# Altium schematic sheet Charger Interface - J1772 Interface.SchDoc: Charger Interface - J1772 Interface
size B; Organization: Midnight Sun Solar Rayce Car Team; Address1: University of Waterloo; Address2: 200 University Ave W; Address3: Waterloo, ON, Canada; Address4: N2L 3E9; DocumentNumber: 3; SheetNumber: 3; SheetTotal: 3; Website: www.uwmidsun.com; ProjectName: ProjectName
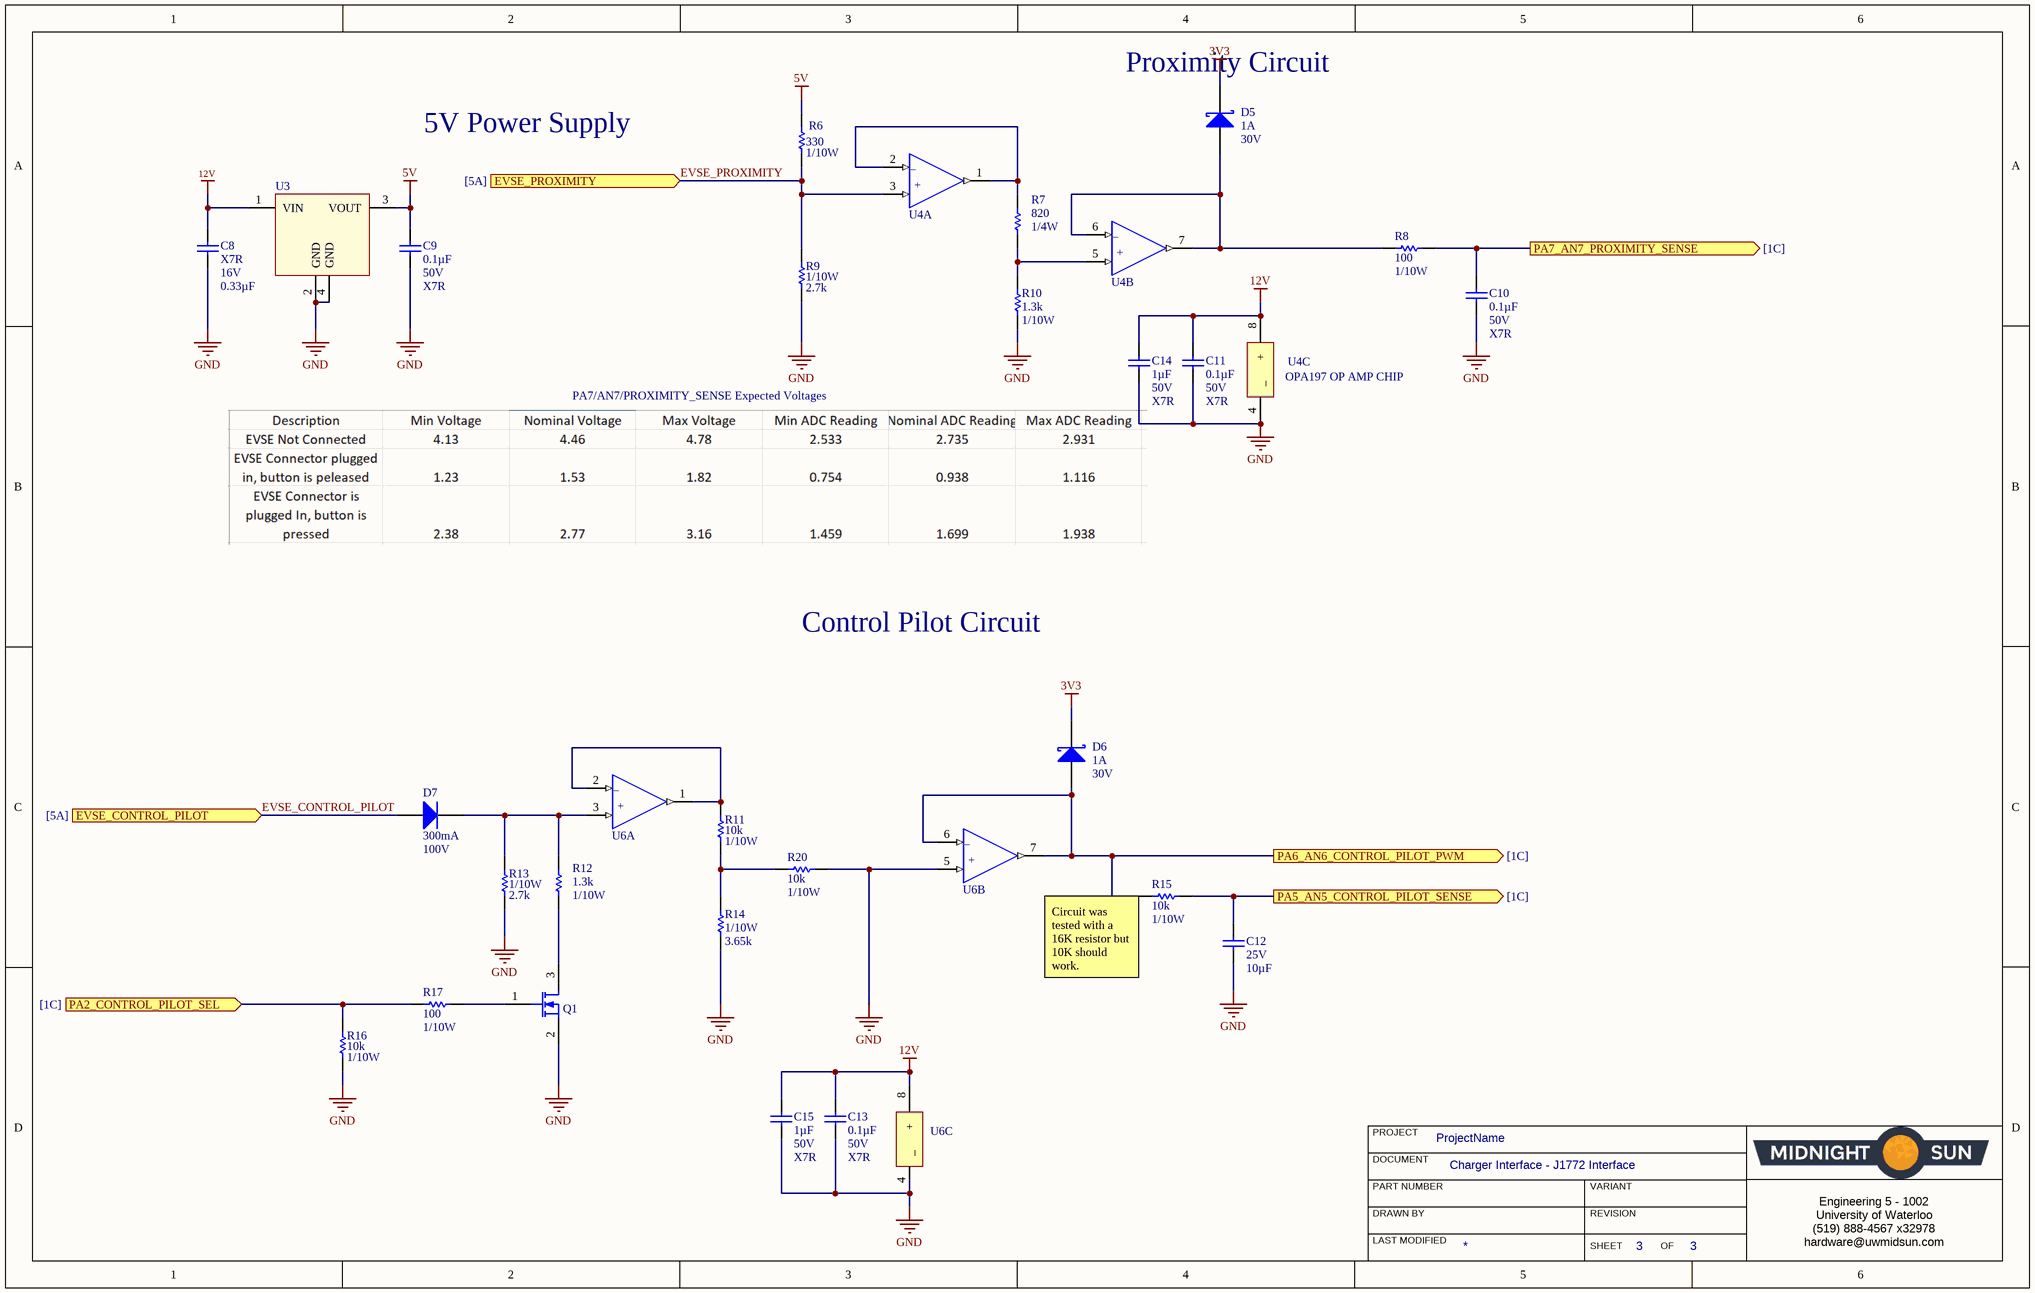
[diagram p0: Charger Interface - J1772 Interface.SchDoc]

## Parts
C8  Dielectric: X7R  Voltage: 16V  Capacitance: 0.33µF  [CAP, 0603]  (hidden comment: CAP CER 0.33UF 16V 10% X7R 0603)
C9  Capacitance: 0.1µF  Voltage: 50V  Temperature Coefficient: X7R  [CAP, 0603]  (hidden comment: CAP CER 0.1UF 50V 10% X7R 0603)
C10  Capacitance: 0.1µF  Voltage: 50V  Temperature Coefficient: X7R  [CAP, 0603]  (hidden comment: CAP CER 0.1UF 50V 10% X7R 0603)
C11  Capacitance: 0.1µF  Voltage: 50V  Temperature Coefficient: X7R  [CAP, 0603]  (hidden comment: CAP CER 0.1UF 50V 10% X7R 0603)
C12  Voltage - Rated: 25V  Capacitance: 10µF  [CAP, 0805]  (hidden comment: CAP CER 10uF 25V 10% X5R 0805)
C13  Capacitance: 0.1µF  Voltage: 50V  Temperature Coefficient: X7R  [CAP, 0603]  (hidden comment: CAP CER 0.1UF 50V 10% X7R 0603)
C14  Capacitance: 1µF  Voltage: 50V  Temperature Coefficient: X7R  [CAP, 0603]  (hidden comment: CAP CER 1UF 50V 10% X7R 0603)
C15  Capacitance: 1µF  Voltage: 50V  Temperature Coefficient: X7R  [CAP, 0603]  (hidden comment: CAP CER 1UF 50V 10% X7R 0603)
D5  Current - Average Rectified (Io): 1A  Voltage - DC Reverse (Vr) (Max): 30V  [DIODE SCHOTTKY 30V 1A POWERDI123]  (hidden comment: DIODE SCHOTTKY 30V 1A POWERDI123)
D6  Current - Average Rectified (Io): 1A  Voltage - DC Reverse (Vr) (Max): 30V  [DIODE SCHOTTKY 30V 1A POWERDI123]  (hidden comment: DIODE SCHOTTKY 30V 1A POWERDI123)
D7  Forward Current: 300mA  Max Repetitive Reverse Voltage (Vrrm): 100V  [DIODE GEN PURP 100V 300MA SOD123]  (hidden comment: DIODE GEN PURP 100V 300MA SOD123)
Q1  MOSFET N-CH 30V 6.2A 0.9W SOT-23  [MOSFET N-CH 30V 6.2A 0.9W SOT-23]  (value not drawn)
R6  Resistance: 330  Power: 1/10W  [RES, 0603]  (hidden comment: RES 330 OHM 1% 1/10W 0603)
R7  Resistance: 820  Power: 1/4W  [RES, 0603]  (hidden comment: RES 820 OHM 5% 1/4W 0603)
R8  Resistance: 100  Power: 1/10W  [RES, 0603]  (hidden comment: RES 100 OHM 1% 1/10W 0603)
R9  Power: 1/10W  Resistance: 2.7k  [RES, 0603]  (hidden comment: RES 2.7K OHM 1% 1/10W 0603)
R10  Resistance: 1.3k  Power Rating: 1/10W  [RES, 0603]  (hidden comment: RES 1.3K OHM 1% 1/10W 0603)
R11  Resistance: 10k  Power: 1/10W  [RES, 0603]  (hidden comment: RES 10K OHM 1% 1/10W 0603)
R12  Resistance: 1.3k  Power Rating: 1/10W  [RES, 0603]  (hidden comment: RES 1.3K OHM 1% 1/10W 0603)
R13  Power: 1/10W  Resistance: 2.7k  [RES, 0603]  (hidden comment: RES 2.7K OHM 1% 1/10W 0603)
R14  Power Rating: 1/10W  Resistance: 3.65k  [RES, 0603]  (hidden comment: RES 3.65K OHM 0.1% 1/10W 0603)
R15  Resistance: 10k  Power: 1/10W  [RES, 0603]  (hidden comment: RES 10K OHM 1% 1/10W 0603)
R16  Resistance: 10k  Power: 1/10W  [RES, 0603]  (hidden comment: RES 10K OHM 1% 1/10W 0603)
R17  Resistance: 100  Power: 1/10W  [RES, 0603]  (hidden comment: RES 100 OHM 1% 1/10W 0603)
R20  Resistance: 10k  Power: 1/10W  [RES, 0603]  (hidden comment: RES 10K OHM 1% 1/10W 0603)
U3  IC REG LDO 5V 0.5A SOT223  [SOT223_N]  (value not drawn)
U4  IC OP AMP DUAL GP RR 10MHZ 8-VSSOP  [IC DUAL OPAMP OPA2197 8-VSSOP]  (value not drawn)  (parts A,B,C of 3)
U6  IC OP AMP DUAL GP RR 10MHZ 8-VSSOP  [IC DUAL OPAMP OPA2197 8-VSSOP]  (value not drawn)  (parts A,B,C of 3)

## Ports
EVSE_CONTROL_PILOT (in, see [5A]), EVSE_PROXIMITY (in, see [5A]), PA2_CONTROL_PILOT_SEL (in, see [1C]), PA5_AN5_CONTROL_PILOT_SENSE (out, see [1C]), PA6_AN6_CONTROL_PILOT_PWM (out, see [1C]), PA7_AN7_PROXIMITY_SENSE (out, see [1C])

## Nets
3V3: D5.2(K) D6.2(K)
5V: C9.1 R6.1 U3.3(VOUT)
12V: C8.1 C11.1 C13.1 C14.1 C15.1 U3.1(VIN) U4.8(+) U6.8(+)
GND: C8.2 C9.2 C10.2 C11.2 C12.2 C13.2 C14.2 C15.2 Q1.2(S) R9.2 R10.2 R13.2 R14.2 R16.2 R20.2 U3.2(GND) U3.4(GND) U4.4(_) U6.4(_) U6.5(+IN_B)
EVSE_CONTROL_PILOT: D7.1(A) ; port EVSE_CONTROL_PILOT
EVSE_PROXIMITY: R6.2 R9.1 U4.3(+IN_A) ; port EVSE_PROXIMITY
PA2_CONTROL_PILOT_SEL: R16.1 R17.1 ; port PA2_CONTROL_PILOT_SEL
PA5_AN5_CONTROL_PILOT_SENSE: C12.1 R15.2 ; port PA5_AN5_CONTROL_PILOT_SENSE
PA6_AN6_CONTROL_PILOT_PWM: D6.1(A) R15.1 U6.6(-IN_B) U6.7(OUT_B) ; port PA6_AN6_CONTROL_PILOT_PWM
PA7_AN7_PROXIMITY_SENSE: C10.1 R8.2 ; port PA7_AN7_PROXIMITY_SENSE
NetD5_1: D5.1(A) R8.1 U4.6(-IN_B) U4.7(OUT_B)
NetD7_2: D7.2(K) R12.1 R13.1 U6.3(+IN_A)
NetQ1_1: Q1.1(G) R17.2
NetQ1_3: Q1.3(D) R12.2
NetR7_1: R7.1 U4.1(OUT_A) U4.2(-IN_A)
NetR7_2: R7.2 R10.1 U4.5(+IN_B)
NetR11_1: R11.1 U6.1(OUT_A) U6.2(-IN_A)
NetR11_2: R11.2 R14.1 R20.1

## Notes on the sheet
- Proximity Circuit
- 5V Power Supply
- PA7/AN7/PROXIMITY_SENSE Expected Voltages
- (near U4) OPA197 OP AMP CHIP
- Control Pilot Circuit
- (near R15) Circuit was tested with a 16K resistor but 10K should work.
- PROJECT
- DOCUMENT
- DRAWN BY
- LAST MODIFIED
- PART NUMBER
- REVISION
- SHEET
- VARIANT
- OF
- Engineering 5 - 1002
  University of Waterloo
  (519) 888-4567 x32978
  hardware@uwmidsun.com

## Library data of the parts
C8 = CAP CER 0.33UF 16V 10% X7R 0603: 0.33µF ±10% 16V Ceramic Capacitor X7R 0603 (1608 Metric); Manufacturer: KEMET; Manufacturer Part Number: C0603C334K4RACTU; Dissipation Factor: 3.5%; Supplier 1: Digi-Key; Stock 1: 94306; Pricing 1: 1=0.3, 10=0.207, 100=0.1173, 500=0.0828, 1000=0.0725 (USD); Mount: Surface Mount,PCB; Case/Package: 0603; Number of Pins: 2; Case Code (Metric): 1608; Case Code (Imperial): 0603; Dielectric Material: Ceramic; Min Operating Temperature: -55°C; Max Operating Temperature: 125°C; Tolerance: 10%; Packaging: Tape and Reel; Voltage Rating: 16V; Voltage Rating (DC): 16V; Package Quantity: 1; Termination: SMD/SMT; Length: 1.6mm; Height: 0.8mm; Width: 0.8mm; Thickness: 0.034inch; Lead Pitch: 0.7mm; Depth: 0.8mm; Radiation Hardening: No; REACH SVHC: No SVHC; ComponentLink1URL: https://datasheet.ciiva.com/5417/kem-c1002-x7r-smd-5417833.pdf; ComponentLink1Description: https://datasheet.ciiva.com/5417/kem-c1002-x7r-smd-5417833.pdf; ComponentLink2URL: https://datasheet.ciiva.com/14594/70095383-14594697.pdf; ComponentLink2Description: https://datasheet.ciiva.com/14594/70095383-14594697.pdf; ComponentLink3URL: https://datasheet.ciiva.com/6136/1776092-6136493.pdf; ComponentLink3Description: https://datasheet.ciiva.com/6136/1776092-6136493.pdf; ComponentLink4URL: https://datasheet.ciiva.com/7823/1776092-7823757.pdf; ComponentLink4Description: https://datasheet.ciiva.com/7823/1776092-7823757.pdf; ComponentLink5URL: https://datasheet.ciiva.com/7823/1776092-7823758.pdf; ComponentLink5Description: https://datasheet.ciiva.com/7823/1776092-7823758.pdf; ComponentLink6URL: https://datasheet.ciiva.com/14596/70095383-14596430.pdf; ComponentLink6Description: https://datasheet.ciiva.com/14596/70095383-14596430.pdf; Supplier Part Number 1: 399-4916-1-ND
C9-C11 C13 = CAP CER 0.1UF 50V 10% X7R 0603: 0.10µF ±10% 50V Ceramic Capacitor X7R 0603 (1608 Metric); Manufacturer 1: AVX Corporation; Manufacturer Part Number 1: 06035C104KAT2A; Supplier 1: Digi-Key; Supplier Part Number 1: 478-5052-1-ND; Packaging: Cut Tape (CT); Part Status: Active; Operating Temperature: -55°C ~ 125°C; Ratings: -; Mounting Type: Surface Mount, MLCC; Package / Case: 0603 (1608 Metric); Size / Dimension: 0.063" L x 0.032" W (1.60mm x 0.81mm); Height - Seated (Max): -; Thickness (Max): 0.035" (0.90mm); Lead Spacing: -; Lead Style: -; ComponentLink1URL: http://datasheets.avx.com/X7RDielectric.pdf; ComponentLink1Description: http://datasheets.avx.com/X7RDielectric.pdf; Tolerance: ±10%
C12 = CAP CER 10uF 25V 10% X5R 0805: 10µF ±10% 25V Ceramic Capacitor X5R 0805 (2012 Metric); Manufacturer: Murata Electronics North America; Manufacturer Part Number: GRM21BR61E106KA73L; Supplier 1: Digi-Key; RoHS: RoHS Compliant; Category: Capacitors; Stock 1: 1695157; Packaging: Cut Tape (CT); Part Status: Active; Tolerance: ±10%; Temperature Coefficient: X5R; Operating Temperature: -55°C ~ 85°C; Features: -; Ratings: -; Applications: General Purpose; Mounting Type: Surface Mount, MLCC; Package / Case: 0805 (2012 Metric); Size / Dimension: 0.079" L x 0.049" W (2.00mm x 1.25mm); Height - Seated (Max): -; Thickness (Max): 0.053" (1.35mm); Lead Spacing: -; Lead Style: -; ComponentLink1URL: http://search.murata.co.jp/Ceramy/image/img/A01X/G101/ENG/GRM21BR61E106KA73-01.pdf; ComponentLink1Description: http://search.murata.co.jp/Ceramy/image/img/A01X/G101/ENG/GRM21BR61E106KA73-01.pdf; Supplier Part Number 1: 490-5523-1-ND; Pricing 1: 1=0.3, 10=0.214, 100=0.1008, 500=0.07068, 1000=0.05851 (CAD)
C14 C15 = CAP CER 1UF 50V 10% X7R 0603: 1µF ±10% 50V Ceramic Capacitor X7R 0603 (1608 Metric); Manufacturer 1: Taiyo Yuden; Manufacturer Part Number 1: UMK107AB7105KA-T; Supplier 1: Digi-Key; Supplier Part Number 1: 587-3247-1-ND; Packaging: Cut Tape (CT); Part Status: Active; Operating Temperature: -55°C ~ 125°C; Ratings: -; Mounting Type: Surface Mount, MLCC; Package / Case: 0603 (1608 Metric); Size / Dimension: 0.063" L x 0.031" W (1.60mm x 0.80mm); Height - Seated (Max): -; Thickness (Max): 0.037" (0.95mm); Lead Spacing: -; Lead Style: -; ComponentLink1URL: http://www.yuden.co.jp/productdata/catalog/en/mlcc_all_e.pdf; ComponentLink1Description: http://www.yuden.co.jp/productdata/catalog/en/mlcc_all_e.pdf; Tolerance: ±10%
D5 D6 = DIODE SCHOTTKY 30V 1A POWERDI123: Diode Schottky 30V 1A Surface Mount PowerDI™ 123; Manufacturer: Diodes Incorporated; Manufacturer Part Number: DFLS130L-7; Speed: Fast Recovery =< 500ns, > 200mA (Io); Current - Reverse Leakage @ Vr: 1mA @ 30V; Capacitance @ Vr, F: 76pF @ 10V, 1MHz; Voltage - Forward (Vf) (Max) @ If: 310mV @ 1A; Supplier 1: Digi-Key; RoHS: RoHS Compliant; Category: Discrete Semiconductor Products; Stock 1: 68200; Packaging: Cut Tape (CT); Part Status: Active; Diode Type: Schottky; Mounting Type: Surface Mount; Package / Case: POWERDI®123; Supplier Device Package: PowerDI™ 123; Operating Temperature - Junction: -40°C ~ 125°C; ComponentLink1URL: https://www.diodes.com/assets/Datasheets/ds30492.pdf; ComponentLink1Description: https://www.diodes.com/assets/Datasheets/ds30492.pdf; Supplier Part Number 1: DFLS130LDICT-ND; Pricing 1: 1=0.7, 10=0.599, 100=0.447, 500=0.35126, 1000=0.27142 (CAD)
D7 = DIODE GEN PURP 100V 300MA SOD123: Diode Standard 100V 300mA (DC) Surface Mount SOD-123; Manufacturer: Diodes Zetex; Manufacturer Part Number: 1N4148WQ-7-F; Max Surge Current: 2A; Forward Voltage: 1.25V; Element Configuration: Single; Recovery Time: 4ns; Peak Reverse Current: 50uA; Max Power Dissipation: 400mW; Supplier 1: Digi-Key; Stock 1: 229; Pricing 1: 1=0.22, 10=0.196, 100=0.107, 500=0.0658, 1000=0.0449 (USD); Mount: Surface Mount; Case/Package: SOD-123-2; Number of Pins: 2; Weight: 0.000353oz; Contact Plating: Tin,Matte; Min Operating Temperature: -65°C; Max Operating Temperature: 150°C; Packaging: Tape and Reel; Peak Non-Repetitive Surge Current: 2A; Package Quantity: 3000; Reverse Recovery Time: 4ns; Lead Free: Lead Free; ComponentLink1URL: http://components.arrow.com/part/dataview/0323_07206809; ComponentLink1Description: http://components.arrow.com/part/dataview/0323_07206809; ComponentLink2URL: http://www.diodes.com/datasheets/ds30086.pdf; ComponentLink2Description: http://www.diodes.com/datasheets/ds30086.pdf; ComponentLink3URL: http://www.mouser.com/ds/2/115/ds30086-318161.pdf; ComponentLink3Description: http://www.mouser.com/ds/2/115/ds30086-318161.pdf; Supplier Part Number 1: 1N4148WQ-7-FDICT-ND
Q1 = MOSFET N-CH 30V 6.2A 0.9W SOT-23: N-Channel 30V 6.2A (Ta) 900mW (Ta) Surface Mount SOT-23; Manufacturer: Diodes; Manufacturer Part Number: DMN3023L-7; Rds On Max: 25mR; Input Capacitance: 873pF; Supplier 1: Digi-Key; Stock 1: 38246; Pricing 1: 1=0.47, 10=0.368, 100=0.2529, 500=0.1734, 1000=0.1301 (USD); Mount: Surface Mount; Case/Package: TO-236-3; Min Operating Temperature: -55°C; Max Operating Temperature: 150°C; Packaging: Tape and Reel; Drain to Source Voltage (Vdss): 30V; Continuous Drain Current (ID): 6.2A; Max Power Dissipation: 900mW; ComponentLink1URL: https://www.diodes.com/assets/Datasheets/DMN3023L.pdf; ComponentLink1Description: https://www.diodes.com/assets/Datasheets/DMN3023L.pdf; ComponentLink2URL: http://www.mouser.com/ds/2/115/DMN3023L-959533.pdf; ComponentLink2Description: http://www.mouser.com/ds/2/115/DMN3023L-959533.pdf; Supplier Part Number 1: DMN3023L-7DICT-ND
R6 = RES 330 OHM 1% 1/10W 0603: 330 Ohms ±1% 0.1W, 1/10W Chip Resistor 0603 (1608 Metric) Automotive AEC-Q200, Moisture Resistant Thick Film; Manufacturer: TE Connectivity; Manufacturer Part Number: 1-2176339-9; Supplier 1: Digi-Key; Stock 1: 0; Supplier Part Number 1: A129682TR-ND
R7 = RES 820 OHM 5% 1/4W 0603: RES SMD 820 OHM 5% 1/4W 0603; Manufacturer 1: Rohm Semiconductor; Manufacturer Part Number 1: ESR03EZPJ821; Temperature Coefficient: ±200ppm/°C; Supplier 1: Digi-Key; Supplier Part Number 1: RHM820DCT-ND; Packaging: Cut Tape (CT); Part Status: Active; Composition: Thick Film; Operating Temperature: -55°C ~ 155°C; Package / Case: 0603 (1608 Metric); Supplier Device Package: 0603; Size / Dimension: 0.063" L x 0.031" W (1.60mm x 0.80mm); Height - Seated (Max): 0.022" (0.55mm); Failure Rate: -; ComponentLink1URL: http://www.rohm.com/web/global/datasheet/ESR01MZPF/esr-e; ComponentLink1Description: http://www.rohm.com/web/global/datasheet/ESR01MZPF/esr-e; Tolerance: ±5%
R8 R17 = RES 100 OHM 1% 1/10W 0603: 100 Ohm ±1% 0.1W, 1/10W Chip Resistor 0603 (1608 Metric) Moisture Resistant Thick Film; Manufacturer 1: Yageo; Manufacturer Part Number 1: RC0603FR-07100RL; Temperature Coefficient: ±100ppm/°C; Supplier 1: Digi-Key; Supplier Part Number 1: 311-100HRCT-ND; Packaging: Cut Tape (CT); Part Status: Active; Composition: Thick Film; Operating Temperature: -55°C ~ 155°C; Package / Case: 0603 (1608 Metric); Supplier Device Package: 0603; Size / Dimension: 0.063" L x 0.031" W (1.60mm x 0.80mm); Height - Seated (Max): 0.022" (0.55mm); Failure Rate: -; ComponentLink1URL: http://www.yageo.com/documents/recent/PYu-RC_Group_51_RoHS_L_7.pdf; ComponentLink1Description: http://www.yageo.com/documents/recent/PYu-RC_Group_51_RoHS_L_7.pdf; Tolerance: ±1%
R9 R13 = RES 2.7K OHM 1% 1/10W 0603: 2.7 kOhms ±1% 0.1W, 1/10W Chip Resistor 0603 (1608 Metric) Automotive AEC-Q200, Moisture Resistant Thick Film; Manufacturer: TE Connectivity; Manufacturer Part Number: 3-2176339-0; Stock 1: 0; Supplier 1: Digi-Key; Supplier Part Number 1: A129693TR-ND
R10 R12 = RES 1.3K OHM 1% 1/10W 0603: 1.3 kOhms ±1% 0.1W, 1/10W Chip Resistor 0603 (1608 Metric) Moisture Resistant Thick Film; Manufacturer: Yageo; Manufacturer Part Number: RC0603FR-071K3L; Voltage Rating: 50V; Temperature Coefficient: 100ppm/°C; Working Voltage: 75V; Supplier 1: Digi-Key; Pricing 1: 1=0.1, 10=0.015, 100=0.006, 1000=0.0027, 2500=0.0023 (USD); Case/Package: 0603; Case Code (Imperial): 0603; Case Code (Metric): 1608; Min Operating Temperature: -55°C; Max Operating Temperature: 155°C; Tolerance: 1%; Packaging: Tape and Reel; Termination: SMD/SMT; Composition: Thick Film; Military Standard: Not; Voltage Rating (DC): 50V; Number of Terminations: 2; Length: 1.6mm; Depth: 0.8mm; Width: 800um; Lead Free: Lead Free; ComponentLink1URL: http://components.arrow.com/part/dataview/0323_00200771; ComponentLink1Description: http://components.arrow.com/part/dataview/0323_00200771; ComponentLink2URL: http://www.mouser.com/ds/2/447/RC0603-272842.pdf; ComponentLink2Description: http://www.mouser.com/ds/2/447/RC0603-272842.pdf; ComponentLink3URL: http://www.yageo.com.tw/exep/pages/download/literatures/PYu-R_INT-thick_7.pdf; ComponentLink3Description: http://www.yageo.com.tw/exep/pages/download/literatures/PYu-R_INT-thick_7.pdf; ComponentLink4URL: http://www.yageo.com/documents/recent/PYu-RC0603_51_RoHS_L_v5.pdf; ComponentLink4Description: http://www.yageo.com/documents/recent/PYu-RC0603_51_RoHS_L_v5.pdf; Supplier Part Number 1: 311-1.30KHRCT-ND; Stock 1: 57984
R11 R15 R16 R20 = RES 10K OHM 1% 1/10W 0603: RES SMD 10K OHM 1% 1/10W 0603; Manufacturer 1: Yageo; Manufacturer Part Number 1: RC0603FR-0710KL; Temperature Coefficient: ±100ppm/°C; Supplier 1: Digi-Key; Supplier Part Number 1: 311-10.0KHRCT-ND; Packaging: Cut Tape (CT); Part Status: Active; Composition: Thick Film; Operating Temperature: -55°C ~ 155°C; Package / Case: 0603 (1608 Metric); Supplier Device Package: 0603; Size / Dimension: 0.063" L x 0.031" W (1.60mm x 0.80mm); Height - Seated (Max): 0.022" (0.55mm); Failure Rate: -; ComponentLink1URL: http://www.yageo.com/documents/recent/PYu-RC_Group_51_RoHS_L_7.pdf; ComponentLink1Description: http://www.yageo.com/documents/recent/PYu-RC_Group_51_RoHS_L_7.pdf; Tolerance: ±1%
R14 = RES 3.65K OHM 0.1% 1/10W 0603: 3.65 kOhms ±0.1% 0.1W, 1/10W Chip Resistor 0603 (1608 Metric) Automotive AEC-Q200 Thin Film; Manufacturer: Panasonic; Manufacturer Part Number: ERA3AEB3651V; Voltage Rating: 150V; Temperature Coefficient: 25ppm/°C; Max Power Dissipation: 100mW; Voltage Rating (DC): 75V; Supplier 1: Digi-Key; Stock 1: 140813; Pricing 1: 1=0.35, 10=0.3, 100=0.1172, 1000=0.0491, 2500=0.045 (USD); Mount: Surface Mount; Case/Package: 0603; Number of Pins: 2; Weight: 7.1E-05oz; Case Code (Metric): 1608; Case Code (Imperial): 0603; Contact Plating: Tin; Min Operating Temperature: -55°C; Max Operating Temperature: 155°C; Tolerance: 0.1%; Packaging: Tape and Reel; Package Quantity: 1; Composition: Metal Film,Thin Film; Number of Terminations: 2; Termination: SMD/SMT; Military Standard: Not; Length: 1.6mm; Height: 0.45mm; Width: 0.8mm; Depth: 0.8mm; Radiation Hardening: No; Lead Free: Lead Free; ComponentLink1URL: https://datasheet.ciiva.com/11810/0900766b80eb1d8c-11810288.pdf; ComponentLink1Description: https://datasheet.ciiva.com/11810/0900766b80eb1d8c-11810288.pdf; ComponentLink2URL: https://datasheet.ciiva.com/5974/485442-5974022.pdf; ComponentLink2Description: https://datasheet.ciiva.com/5974/485442-5974022.pdf; ComponentLink3URL: https://datasheet.ciiva.com/9196/aoa0000ce26-9196230.pdf; ComponentLink3Description: https://datasheet.ciiva.com/9196/aoa0000ce26-9196230.pdf; ComponentLink4URL: https://datasheet.ciiva.com/7911/485442-7911543.pdf; ComponentLink4Description: https://datasheet.ciiva.com/7911/485442-7911543.pdf; ComponentLink5URL: https://datasheet.ciiva.com/17213/aoa0000ce26-17213543.pdf; ComponentLink5Description: https://datasheet.ciiva.com/17213/aoa0000ce26-17213543.pdf; ComponentLink6URL: https://datasheet.ciiva.com/41450/001180837-da-01-en-widerstand-era-0603-3k65-0-1-5000st-41450154.pdf; ComponentLink6Description: https://datasheet.ciiva.com/41450/001180837-da-01-en-widerstand-era-0603-3k65-0-1-5000st-41450154.pdf; Supplier Part Number 1: P3.65KDBCT-ND
U3 = IC REG LDO 5V 0.5A SOT223: Linear Voltage Regulator IC Positive Fixed Output 5V 500mA SOT-223-4; Manufacturer 1: Texas Instruments; Manufacturer Part Number 1: UA78M05IDCYR; Voltage - Dropout (Typical): 2V @ 350mA; Voltage - Input: 7 V ~ 25 V; Supplier 1: Digi-Key; Supplier Part Number 1: 296-17616-1-ND; Packaging: Cut Tape (CT); Part Status: Active; Regulator Topology: Positive Fixed; Voltage - Output: 5V; Current - Output: 500mA; Current - Limit (Min): -; Operating Temperature: -40°C ~ 125°C; Mounting Type: Surface Mount; Package / Case: TO-261-4, TO-261AA; ComponentLink1URL: http://www.ti.com/lit/ds/symlink/ua78m.pdf; ComponentLink1Description: http://www.ti.com/lit/ds/symlink/ua78m.pdf; Supplier Device Package: SOT-223-4
U4 U6 = IC OP AMP DUAL GP RR 10MHZ 8-VSSOP: General Purpose Amplifier 2 Circuit Rail-to-Rail 8-VSSOP; Manufacturer: Texas Instruments; Manufacturer Part Number: OPA2197IDGKR; Number of Circuits: 2; Slew Rate: 20V/µs; Input Bias Current: 5pA; Input Offset Voltage (Vos): 250uV; Operating Supply Current: 1mA; Output Current per Channel: 65mA; Supplier 1: Digi-Key; Stock 1: 2171; Pricing 1: 1=2.41, 10=2.162, 100=1.7376, 500=1.4276, 1000=1.1829 (USD); Mount: Surface Mount; Case/Package: VSSOP; Min Operating Temperature: -40°C; Max Operating Temperature: 125°C; Packaging: Tape and Reel; Gain Bandwidth Product: 10MHz; Number of Channels: 2; Lead Free: Lead Free; ComponentLink1URL: http://www.ti.com/lit/ds/symlink/opa2197.pdf; ComponentLink1Description: http://www.ti.com/lit/ds/symlink/opa2197.pdf; Supplier Part Number 1: 296-47349-1-ND